# EAGLE design Emat_300v (EAGLE 7.5.0)
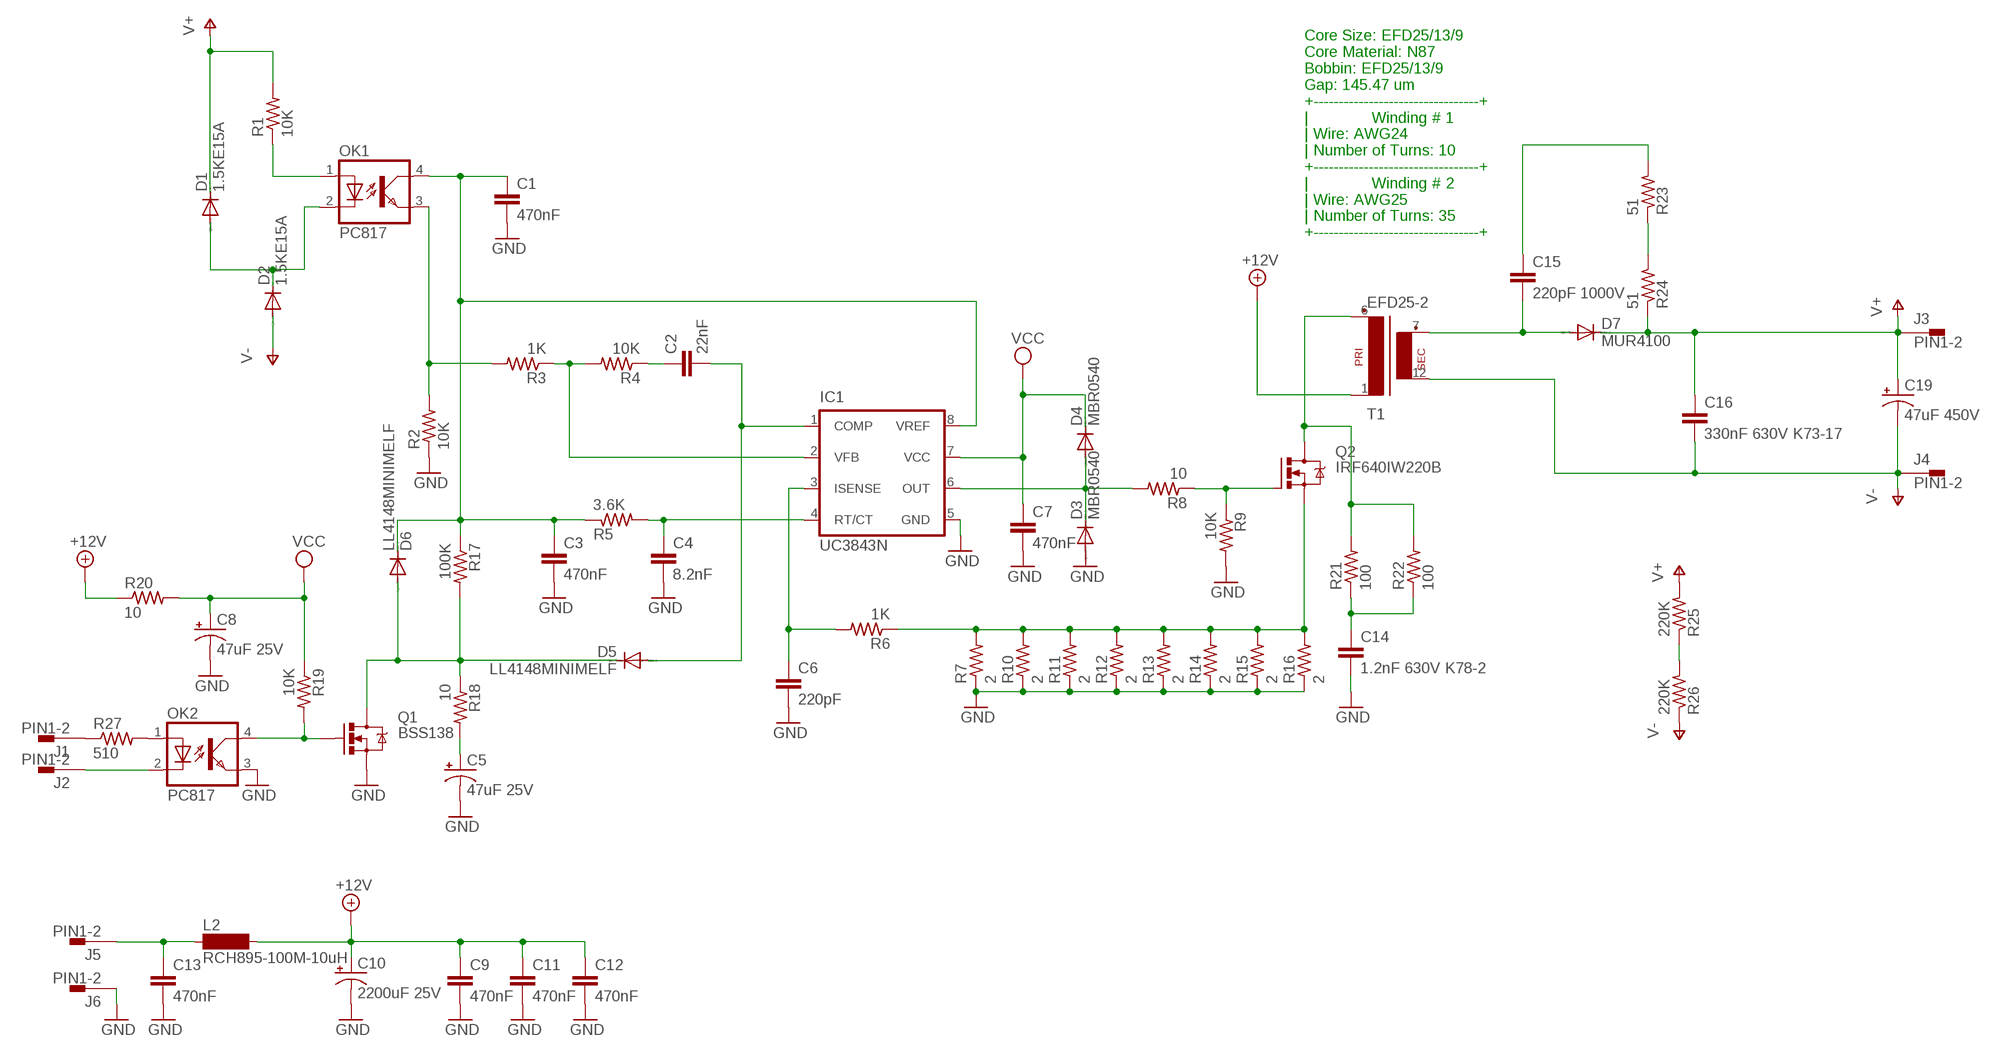
[diagram p0: schematic, sheet 1]

## Parts
C1  470nF  C-EUC0805  [C0805]
C2  22nF  C-EUC0805  [C0805]
C3  470nF  C-EUC0805  [C0805]
C4  8.2nF  C-EUC0805  [C0805]
C5  47uF 25V  CPOL-USE5-8.5  [E5-8,5]
C6  220pF  C-EUC0805  [C0805]
C7  470nF  C-EUC0805  [C0805]
C8  47uF 25V  CPOL-USE5-8.5  [E5-8,5]
C9  470nF  C-EUC0805  [C0805]
C10  2200uF 25V  CPOL-USE7.5-18  [E7,5-18]
C11  470nF  C-EUC0805  [C0805]
C12  470nF  C-EUC0805  [C0805]
C13  470nF  C-EUC0805  [C0805]
C14  1.2nF 630V K78-2  C-EU150-064X183  [C150-064X183]
C15  220pF 1000V  C-EU075-042X103  [C075-042X103]
C16  330nF 630V K73-17  C-EU225-062X268  [C225-062X268]
C19  47uF 450V  CPOL-USE7.5-18  [E7,5-18]
D1  1.5KE15A  DIODE-DO201-15  [DO201-15]
D2  1.5KE15A  DIODE-DO201-15  [DO201-15]
D3  MBR0540  DIODE-SOD123  [SOD123]
D4  MBR0540  DIODE-SOD123  [SOD123]
D5  LL4148MINIMELF  [MINIMELF]
D6  LL4148MINIMELF  [MINIMELF]
D7  MUR4100  DIODE-DO201-15  [DO201-15]
IC1  UC3843N  [DIL08]
J1  PIN1-2  [62221]
J2  PIN1-2  [62221]
J3  PIN1-2  [62221]
J4  PIN1-2  [62221]
J5  PIN1-2  [62221]
J6  PIN1-2  [62221]
L2  RCH895-100M-10uH  RCH-89511  [BS11]
OK1  PC817  [DIL04]
OK2  PC817  [DIL04]
Q1  BSS138  MOSFET-NCHANNELBSS138  [SOT23-3]
Q2  IRF640IW220B  [IW220B]
R1  10K  R-US_R1206  [R1206]
R2  10K  R-US_R1206  [R1206]
R3  1K  R-US_R1206  [R1206]
R4  10K  R-US_R1206  [R1206]
R5  3.6K  R-US_R1206  [R1206]
R6  1K  R-US_R1206  [R1206]
R7  2  R-US_R1206  [R1206]
R8  10  R-US_R1206  [R1206]
R9  10K  R-US_R1206  [R1206]
R10  2  R-US_R1206  [R1206]
R11  2  R-US_R1206  [R1206]
R12  2  R-US_R1206  [R1206]
R13  2  R-US_R1206  [R1206]
R14  2  R-US_R1206  [R1206]
R15  2  R-US_R1206  [R1206]
R16  2  R-US_R1206  [R1206]
R17  100K  R-US_R1206  [R1206]
R18  10  R-US_R1206  [R1206]
R19  10K  R-US_R1206  [R1206]
R20  10  R-US_R1206  [R1206]
R21  100  R-US_R2512  [R2512]
R22  100  R-US_R2512  [R2512]
R23  51  R-US_R1206  [R1206]
R24  51  R-US_R1206  [R1206]
R25  220K  R-US_R1206  [R1206]
R26  220K  R-US_R1206  [R1206]
R27  510  R-US_R1206  [R1206]
T1  EFD25-2  [EFD25]

## Nets
+12V: C9.1 C10.+ C11.1 C12.1 L2.2 R20.1 T1.1
GND: C1.2 C3.2 C4.2 C5.- C6.2 C7.2 C8.- C9.2 C10.- C11.2 C12.2 C13.2 C14.2 D3.A IC1.5(GND) J6.1 OK2.3(EMIT) Q1.2(S) R2.1 R7.1 R9.2 R10.1 R11.1 R12.1 R13.1 R14.1 R15.1 R16.1
N$1: D1.A D2.C OK1.2(C)
N$2: R25.1 R26.2
N$3: OK1.1(A) R1.1
N$4: C5.+ R18.2
N$5: OK1.3(EMIT) R2.2 R3.2
N$6: IC1.2(VFB) R3.1 R4.2
N$7: C2.1 R4.1
N$8: C2.2 D5.A IC1.1(COMP)
N$9: C4.1 IC1.4(RT/CT) R5.2
N$10: C6.1 IC1.3(ISENSE) R6.2
N$11: D3.C D4.A IC1.6(OUT) R8.2
N$12: Q2.G R8.1 R9.1
N$13: Q2.S R6.1 R7.2 R10.2 R11.2 R12.2 R13.2 R14.2 R15.2 R16.2
N$14: C1.1 C3.1 D6.C IC1.8(VREF) OK1.4(COL) R5.1 R17.1
N$15: D5.C D6.A Q1.3(D) R17.2 R18.1
N$16: C13.1 J5.1 L2.1
N$17: OK2.4(COL) Q1.1(G) R19.2
N$18: OK2.1(A) R27.2
N$19: J2.1 OK2.2(C)
N$20: Q2.D R21.2 R22.2 T1.6(P2)
N$21: C14.1 R21.1 R22.1
N$22: C15.2 D7.A T1.7(S1)
N$23: J1.1 R27.1
N$24: R23.1 R24.2
N$25: C15.1 R23.2
V+: C16.1 C19.+ D1.C D7.C J3.1 R1.2 R24.1 R25.2
V-: C16.2 C19.- D2.A J4.1 R26.1 T1.12(S2)
VCC: C7.1 C8.+ D4.C IC1.7(VCC) R19.1 R20.2

## Notes on the sheet
- Core Size: EFD25/13/9
  Core Material: N87
  Bobbin: EFD25/13/9
  Gap: 145.47 um
  +---------------------------------+
  |              Winding # 1             
  | Wire: AWG24
  | Number of Turns: 10
  +---------------------------------+
  |              Winding # 2             
  | Wire: AWG25
  | Number of Turns: 35
  +---------------------------------+

## Library data of the parts
C1-C4 C6 C7 C9 C11-C16 = rcl:C-EU: CAPACITOR, European symbol
C5 C8 C10 C19 = rcl:CPOL-US: POLARIZED CAPACITOR, American symbol
D1-D4 D7 = diode:DIODE-: DIODE
D5 D6 = diode:LL4148: DIODE high speed (Philips)
IC1 = v-reg:UC384*: SMPS Controller Source: http://www.fairchildsemi.com/ds/UC/UC3843.pdf
J1-J6 = con-faston:PIN1-2: CONN TAB FASTON BRASS .187 PCB TAB, FSSTON, DUAL STAKE, .187 SERIES Digi-Key Part Number: A24734CT-ND Source: Tyco Electronics Corporation .. ENG_CD_62221_R.pdf http://search.digikey.com/scripts/DkSearch/dksus.dll?Detail&name=A24734CT-ND; MF: TYCO ELECTRONICS; MPN: 62221-1; OC_FARNELL: unknown; OC_NEWARK: 16H2318
L2 = inductor-neosid:RCH-895: INDUCTOR nominal inductance, magnetically screened; OC_FARNELL: unknown; OC_NEWARK: unknown
OK1 OK2 = optocoupler:PC817: SHARP OPTO COUPLER; MPN: PC817X4J000F; OC_FARNELL: 9707727; OC_NEWARK: 97K7059
Q1 = SparkFun-DiscreteSemi:MOSFET-NCHANNEL: Common NMOSFET Parts MFG P/N Store ID Prod ID FDD8780 TRANS-09984 SI7820DN TRANS-11055 FDS6630A IC-08089 2N7002PW TRANS-11151 FQP30N06L COM-10213 TRANS-10060 BSS123LT1G TRANS-08345 BSS138 TRANS-00830 BS170 2N7000; PROD_ID: TRANS-00830; VALUE: 200mA/50V
Q2 = transistor-power:IRF640: HEXFET Power MOSFET
R1-R27 = resistor:R-US_: RESISTOR, American symbol
T1 = trafo:EFD25-2

## Board
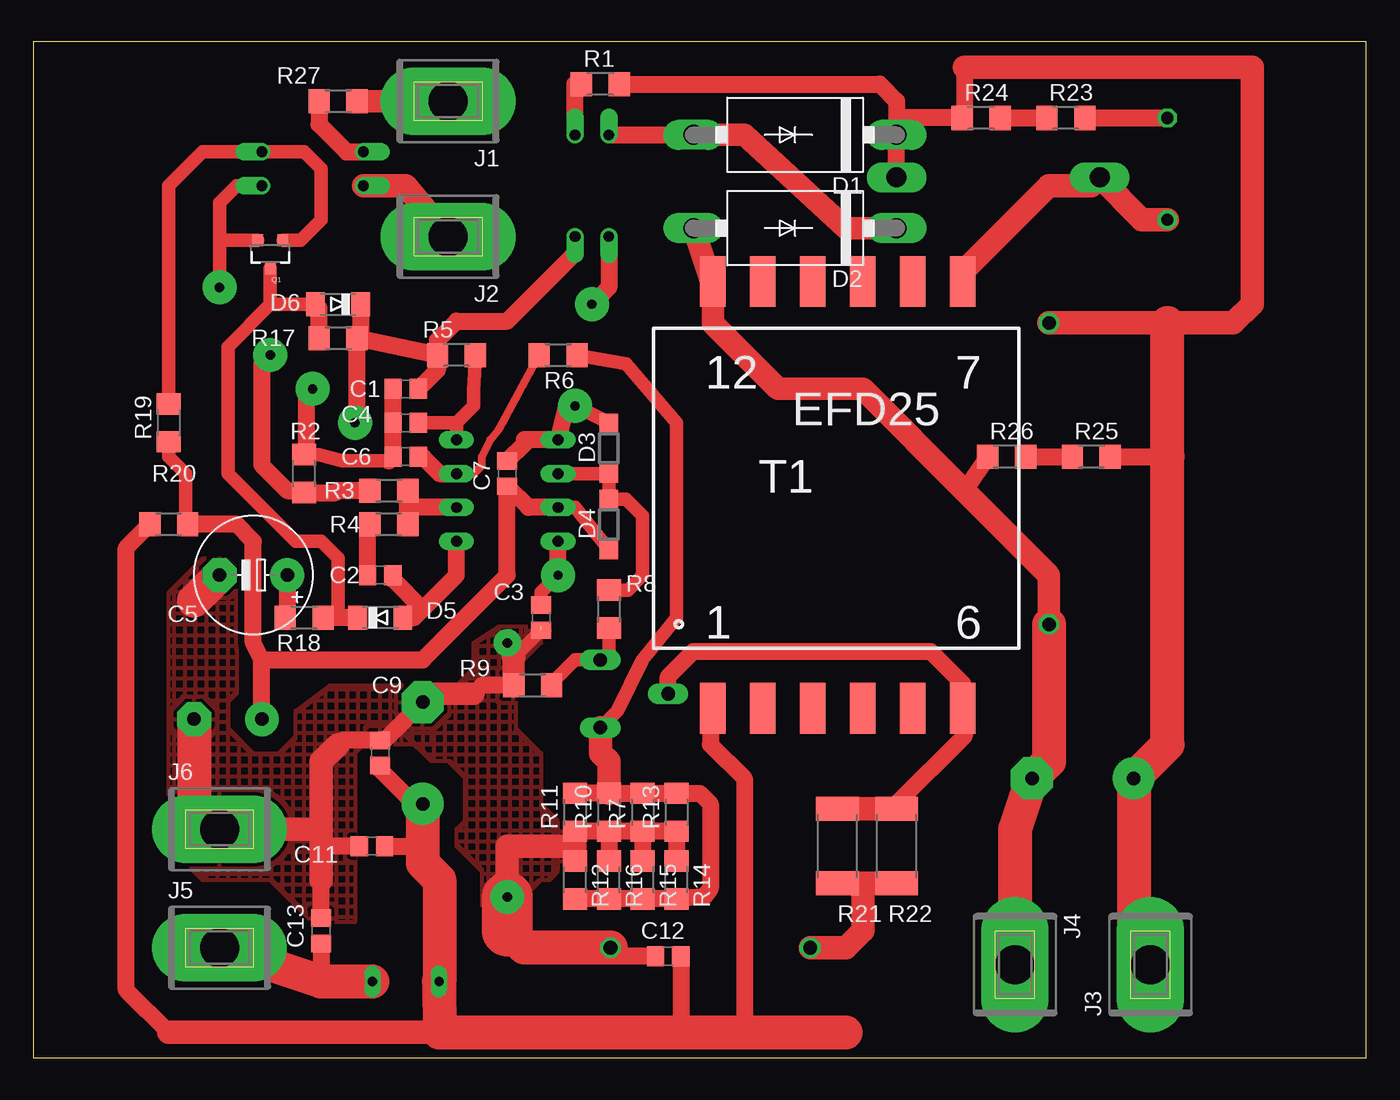
[diagram p1: board, top side]
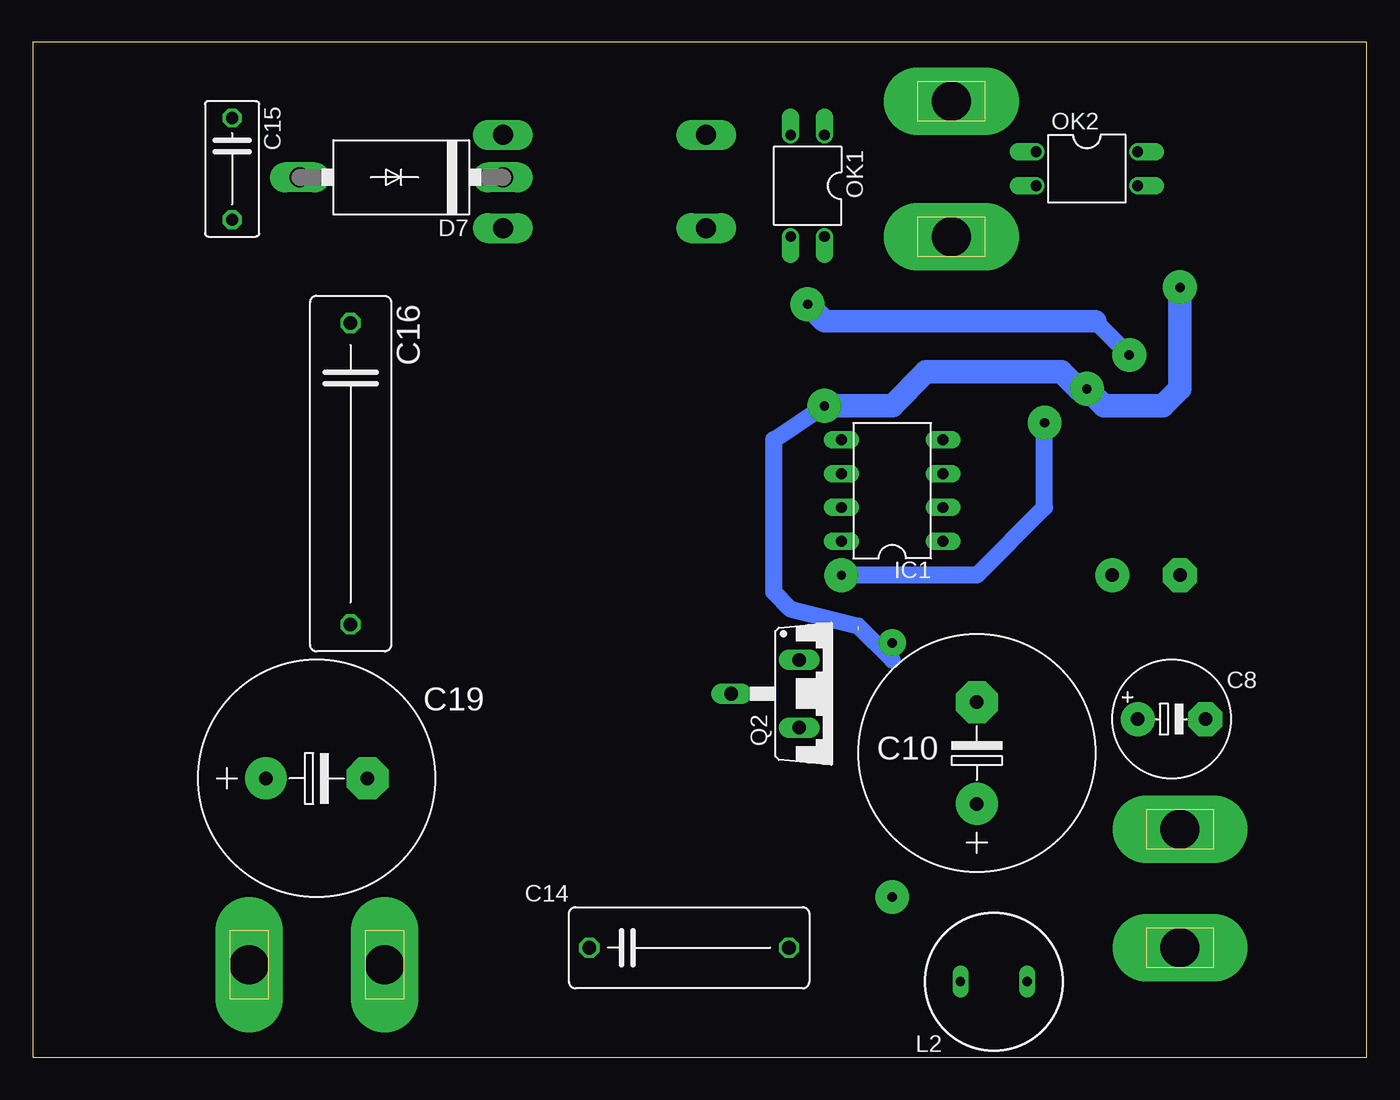
[diagram p2: board, bottom side, seen from below]

Size 100 x 76.19 mm. Coordinates in mm from the lower left corner, seen from the top.
Outline: 0,0 100,0 100,76.19 0,76.19 0,0
Copper layers (1*16): Top 0.035mm / dielectric 1.5mm / Bottom 0.035mm
Design rules "default *": minimum track width 10mil, minimum drill 25mil, track to track 20mil, track to pad 20mil, pad to pad 8mil, via to via 8mil, smd to smd 8mil, copper to edge 40mil, drill to drill 8mil, minimum pad ring 10mil, minimum via ring 8mil, stop-mask expansion 4mil, vias tented up to drill 0mil, thermal gap 10mil

### Footprints (pad centres in the part's own frame; a part is rotated, then mirrored left to right if it is on the bottom)
C0805 = smd 1.3 x 1.5: 1 -0.95,0; 2 0.95,0
E5-8,5 = drill 1.016 pad 2.54: + -2.54,0 | drill 1.016 pad 2.54 octagon: - 2.54,0
E7,5-18 = drill 1.016 pad 3.15: + -3.81,0 | drill 1.016 pad 3.15 octagon: - 3.81,0
C150-064X183 = drill 1.016 octagon: 1 -7.493,0; 2 7.493,0
C075-042X103 = drill 0.914 octagon: 1 -3.81,0; 2 3.81,0
C225-062X268 = drill 1.016 octagon: 1 -11.303,0; 2 11.303,0
DO201-15 = drill 1.499 long: A 7.62,0; C -7.62,0
SOD123 = smd 1.4 x 1.4: A 1.9,0; C -1.9,0
MINIMELF = smd 1.4 x 1.8: A 1.7,0; C -1.7,0
DIL08 = drill 0.813 long: 1 -3.81,-3.81; 2 -1.27,-3.81; 3 1.27,-3.81; 4 3.81,-3.81; 5 3.81,3.81; 6 1.27,3.81; 7 -1.27,3.81; 8 -3.81,3.81
62221 = drill 2.921 pad 5.08 long: 1 0,0
BS11 = drill 0.7 long: 1 -2.5,0; 2 2.5,0
DIL04 = drill 0.813 offset: 1 -1.27,-3.81; 2 1.27,-3.81; 3 1.27,3.81; 4 -1.27,3.81
SOT23-3 = smd 0.8 x 0.9: 1 -0.95,-1; 2 0.95,-1; 3 0,1.1
IW220B = drill 1.016 long: D 0,-7.62; G -2.54,-2.54; S 2.54,-2.54
R1206 = smd 1.6 x 1.803: 1 -1.422,0; 2 1.422,0
R2512 = smd 1.8 x 3.2: 1 -2.8,0; 2 2.8,0
EFD25 = smd 1.93 x 3.81: 1 -11.25,-11.25; 2 -7.5,-11.25; 3 -3.75,-11.25; 4 0,-11.25; 5 3.75,-11.25; 6 7.5,-11.25; 7 7.5,20.75; 8 3.75,20.75; 9 0,20.75; 10 -3.75,20.75; 11 -7.5,20.75; 12 -11.25,20.75

### Placement (x,y rotation side)
C1  27.94,50.16 180 top
C2  26.04,36.2 0 top
C3  38.1,33.02 270 top
C4  27.94,47.62 180 top
C5  16.51,36.2 180 top
C6  27.94,45.09 180 top
C7  35.56,43.81 90 top
C8  14.61,25.4 0 bottom
C9  26.04,22.86 90 top
C10  29.21,22.86 90 bottom
C11  25.4,15.88 180 top
C12  47.62,7.62 180 top
C13  21.59,9.53 90 top
C14  50.8,8.26 0 bottom
C15  85.09,66.67 270 bottom
C16  76.2,43.81 270 bottom
C19  78.74,20.95 0 bottom
D1  57.15,69.22 180 top
D2  1.5KE300A  [DO201-15]  57.15,62.23 180 top
D3  43.18,45.72 90 top
D4  43.18,40.01 90 top
D5  26.04,33.02 0 top
D6  22.86,56.52 180 top
D7  72.39,66.04 180 bottom
IC1  35.56,42.55 90 bottom
J1  31.11,71.75 180 top
J2  31.11,61.59 180 top
J3  83.82,6.99 90 top
J4  73.66,6.99 270 top
J5  13.97,8.26 0 top
J6  13.97,17.14 0 top
L2  27.94,5.71 180 bottom
OK1  41.91,65.41 180 bottom
OK2  20.95,66.67 270 bottom
Q1  17.78,60.33 180 top
Q2  40.01,27.3 270 bottom
R1  42.55,73.03 0 top
R2  20.32,43.81 270 top
R3  26.67,42.55 180 top
R4  26.67,40.01 0 top
R5  31.75,52.7 0 top
R6  39.37,52.7 180 top
R7  45.72,18.41 90 top
R8  43.18,33.66 90 top
R9  37.47,27.94 180 top
R10  43.18,18.41 90 top
R11  40.64,18.41 90 top
R12  40.64,13.34 270 top
R13  48.26,18.41 90 top
R14  48.26,13.34 270 top
R15  45.72,13.34 270 top
R16  43.18,13.34 270 top
R17  22.86,53.98 180 top
R18  20.32,33.02 180 top
R19  10.16,47.62 90 top
R20  10.16,40.01 0 top
R21  60.33,15.88 90 top
R22  64.77,15.88 90 top
R23  77.47,70.48 0 top
R24  71.12,70.48 0 top
R25  79.38,45.09 0 top
R26  73.03,45.09 0 top
R27  100  [R1206]  22.86,71.75 180 top
T1  62.23,37.47 0 top

### Tracks (layer width: path | path; a pad name or v marks a point on that pad's centre or on a via)
+12V
  Top 1.27: C9.1 26.04,21.59 29.21,18.41 | 10.16,1.91 6.99,5.08 6.99,38.25 R20.1 | 30.48,1.91 30.48,5.67 | 30.48,5.71 30.48,5.67 | 30.48,5.67 L2.2 | C12.1 48.58,2.22 44.45,1.91 | C11.1 29.21,15.88 | T1.1 50.8,26.04 50.8,23.5 53.34,20.95 53.34,1.91
  Top 1.778: 10.16,1.91 30.48,1.91
  Top 2.54: 60.96,1.91 53.34,1.91 44.45,1.91 30.48,1.91 L2.2 30.48,5.75 30.48,13.34 29.21,14.61 29.21,15.88 29.21,18.41 C10.+
GND  (via drill 0.7 pad 2.03, 0.7 pad 2.54)  (1 unrouted)
  Top 1.016: 26.68,44.77 23.18,44.77 21.44,45.24 R2.1 | v13.97,57.78 13.97,61.59 | 13.97,61.59 13.97,64.14 15.24,65.41 OK2.3 | Q1.2 14.24,61.33 13.97,61.59 | D3.A v40.64,48.9 | 36.04,30.01 C3.2
  Top 1.27: C13.2 21.59,13.34 | R10.1 R11.1 40.64,15.88 R12.1 | R7.1 R10.1 | R14.1 R13.1 R7.1 | R7.1 R15.1 | R10.1 R16.1 | 22.86,23.5 23.18,23.81 C9.2 26.35,23.81 C10.- 29.84,27.3 | C7.2 36.83,46.03 36.83,46.35 IC1.5 40.01,48.9 v40.64,48.9 | C8.- 12.06,21.59 11.43,20.95 | 26.68,44.77 C6.2 C4.2 C1.2 | C12.2 40.13,7.62 C14.2 | C11.2 21.59,15.88 | R2.1 20.49,45.41 20.49,49.7 v20.95,50.16 | R9.2 33.66,27.94 33.02,27.3
  Top 1.676: R9.2 36.04,30.01 | 33.02,27.3 29.84,27.3
  Top 1.778: 21.59,17.14 J6.1 | 21.59,13.34 21.59,15.88 21.59,17.14 | 21.59,17.14 21.59,22.23 22.86,23.5 | 40.64,15.88 35.56,15.88 v35.56,12.06 | 36.04,30.01 36.04,30.63 v35.56,31.11
  Top 2.54: C8.- 12.06,18.41 J6.1 | C5.- 12.06,34.29 | C14.2 36.83,8.26 35.56,9.53
  Top 3.81: v35.56,12.06 35.56,9.53
  Bottom 1.27: 35.56,29.84 38.1,32.38 43.18,33.66 44.45,34.92 44.45,46.35 v40.64,48.9
  Bottom 1.778: v13.97,57.78 13.97,50.16 15.24,48.9 19.68,48.9 v20.95,50.16 21.59,50.16 22.86,51.44 33.02,51.44 35.56,48.9 v40.64,48.9
  pour Top (isolate 0.305, hatched): 27.94,27.3 28.57,27.94 31.75,27.94 33.02,29.21 33.02,31.11 34.92,32.38 38.73,32.38 38.73,31.11 38.1,31.11 36.2,29.21 36.2,24.77 38.1,22.86 38.1,19.05 40.01,17.14 40.01,13.97 39.37,13.97 38.73,13.34 38.1,13.34 36.2,11.43 33.66,11.43 33.66,13.97 31.75,15.88 31.75,17.14 32.38,17.78 32.38,20.95 31.11,22.23 29.84,22.23 27.94,24.13
  pour Top (hatched): 20.95,10.16 17.78,13.34 12.7,13.34 10.16,15.88 10.16,34.92 12.7,37.47 15.24,37.47 15.24,27.3 14.61,26.67 14.61,24.77 16.51,22.86 18.41,22.86 19.68,24.13 19.68,26.04 22.23,27.94 29.84,27.94 29.84,23.5 24.77,23.5 24.13,22.86 24.13,10.16
N$1
  Top 1.27: OK1.2 D1.A
  Top 1.676: D1.A 53.34,69.22 60.96,62.23 D2.C
N$2
  Top 1.27: R26.2 R25.1
N$3
  Top 1.27: OK1.1 40.64,73.03 R1.1
N$4
  Top 1.27: C5.+ 19.05,33.17 R18.2
N$5  (via drill 0.7 pad 2.54)
  Top 1.27: R3.2 22.86,42.55 22.71,42.39 R2.2 20.17,42.55 19.05,42.55 17.14,44.45 17.14,52.07 v17.78,52.7 | OK1.3 43.18,57.78 v41.91,56.52
  Bottom 1.27: 20.32,55.24 v17.78,52.7
  Bottom 1.676: 20.32,55.24 40.64,55.24 v41.91,56.52
N$6
  Top 1.27: R4.2 28.09,41.27 | 28.09,41.27 R3.1 | IC1.2 28.09,41.27
N$7
  Top 1.27: C2.1 25.09,39.84 R4.1
N$8
  Top 1.27: D5.A 28.57,33.02 29.21,33.66 | 29.21,33.66 31.75,36.2 IC1.1 | C2.2 26.98,35.88 29.21,33.66
N$9
  Top 1.016: C4.1 31.75,47.62 | 31.75,47.62 33.02,48.9 33.02,50.01 R5.2 | IC1.4 31.75,47.62
N$10
  Top 0.61: IC1.3 33.02,43.81 33.66,44.45 33.66,45.09 34.29,46.35 34.92,47.14 R6.2
  Top 1.27: C6.1 29.21,45.09 30.48,43.81 IC1.3
N$11
  Top 1.016: IC1.6 40.64,43.81 D3.C D4.A 44.45,41.91 45.72,40.64 45.72,36.2 44.6,35.08 R8.2
N$12
  Top 1.016: R9.1 38.89,28.09 40.64,29.84 Q2.G 43.18,30.48 R8.1
N$13
  Top 1.016: R6.1 44.45,52.07 48.26,47.62 48.26,33.02 45.72,29.84 43.81,26.04 Q2.S
  Top 1.27: R12.2 R16.2 R15.2 R14.2 50.32,12.06 50.8,12.7 50.8,19.05 50.01,19.84 R13.2 R7.2 R10.2 R11.2
  Top 1.778: Q2.S 42.55,22.86 43.18,22.23 R10.2
N$14  (via drill 0.7 pad 2.54)
  Top 1.016: C3.1 38.1,34.92 v39.37,36.2
  Top 1.27: v39.37,36.2 IC1.8 | 23.81,47.3 v24.13,47.62 24.28,47.78 R17.1 | R5.1 30.33,51.6 C1.1 | R5.1 R17.1 | R5.1 30.33,53.82 31.75,55.24 35.56,55.24 40.64,60.33 OK1.4 | D6.C 24.56,54.25 R17.1
  Bottom 1.27: v39.37,36.2 29.21,36.2 24.13,41.27 v24.13,47.62
N$15
  Top 1.016: 22.86,33.02 22.86,37.47 21.59,38.73 19.68,38.73 14.61,43.81 14.61,53.34 17.78,56.52 | 17.78,56.52 D6.A | Q1.3 17.78,56.52
  Top 1.27: D5.C 22.86,33.02 R18.1 | R17.2 21.44,56.24 D6.A
N$16
  Top 1.27: C13.1 21.59,5.71
  Top 2.54: L2.1 21.59,5.71 J5.1
N$17
  Top 1.016: R19.2 10.16,65.41 12.7,67.94 OK2.4 20.32,67.94 21.59,66.67 21.59,62.87 20.05,61.33 Q1.1
N$18
  Top 1.27: R27.2 21.44,70 23.5,67.94 OK2.1
N$19
  Top 1.778: OK2.2 27.94,65.41 J2.1
N$20
  Top 1.27: Q2.D 47.62,28.57 49.53,30.48 67.31,30.48 69.73,28.06 T1.6 69.85,26.09 69.85,24.13 64.77,19.05 R22.2
  Top 1.778: R21.2 R22.2
N$21
  Top 1.778: R21.1 62.23,13.07 | 62.23,13.07 R22.1 | C14.1 60.96,8.26 62.23,9.53 62.23,13.07
N$22
  Top 1.778: T1.7 69.73,58.94 76.2,65.41 79.38,65.41 D7.A 83.19,62.87 C15.2
N$23
  Top 1.676: R27.1 J1.1
N$24
  Top 1.27: R24.2 R23.1
N$25
  Top 1.27: R23.2 C15.1
V+
  Top 1.27: R25.2 85.09,45.09 | R1.2 63.5,73.03 64.77,71.75 64.77,70.48 | 64.77,70.48 D1.C D7.C | 64.77,70.48 R24.1 69.85,70.64 69.85,74.3
  Top 1.778: C16.1 85.09,55.12 90.04,55.12 91.44,56.52 91.44,74.3 69.85,74.3
  Top 2.54: J3.1 82.55,8.26 C19.+ 85.09,23.5 85.09,45.09 85.09,55.12
V-
  Top 1.27: R26.1 69.85,42.55 | 50.8,58.4 T1.12
  Top 1.676: T1.12 50.98,55.06 55.88,50.16 62.23,50.16 69.85,42.55 76.2,36.2 C16.2 | D2.A 50.8,58.4
  Top 2.54: C16.2 76.2,22.23 C19.- 73.66,17.14 J4.1
VCC
  Top 1.016: R19.1 10.16,45.09 11.43,43.81 11.43,40.16 R20.2 | IC1.7 40.64,41.27 D4.C
  Top 1.27: IC1.7 37.15,41.27 C7.1 35.56,36.2 29.21,29.84 17.14,29.84 | C8.+ 17.14,29.84 | 17.14,29.84 16.51,31.11 16.51,38.73 15.24,40.01 R20.2